# Altium schematic sheet LEDMATRIX.SchDoc
size D; SheetNumber: 1; SheetTotal: 1
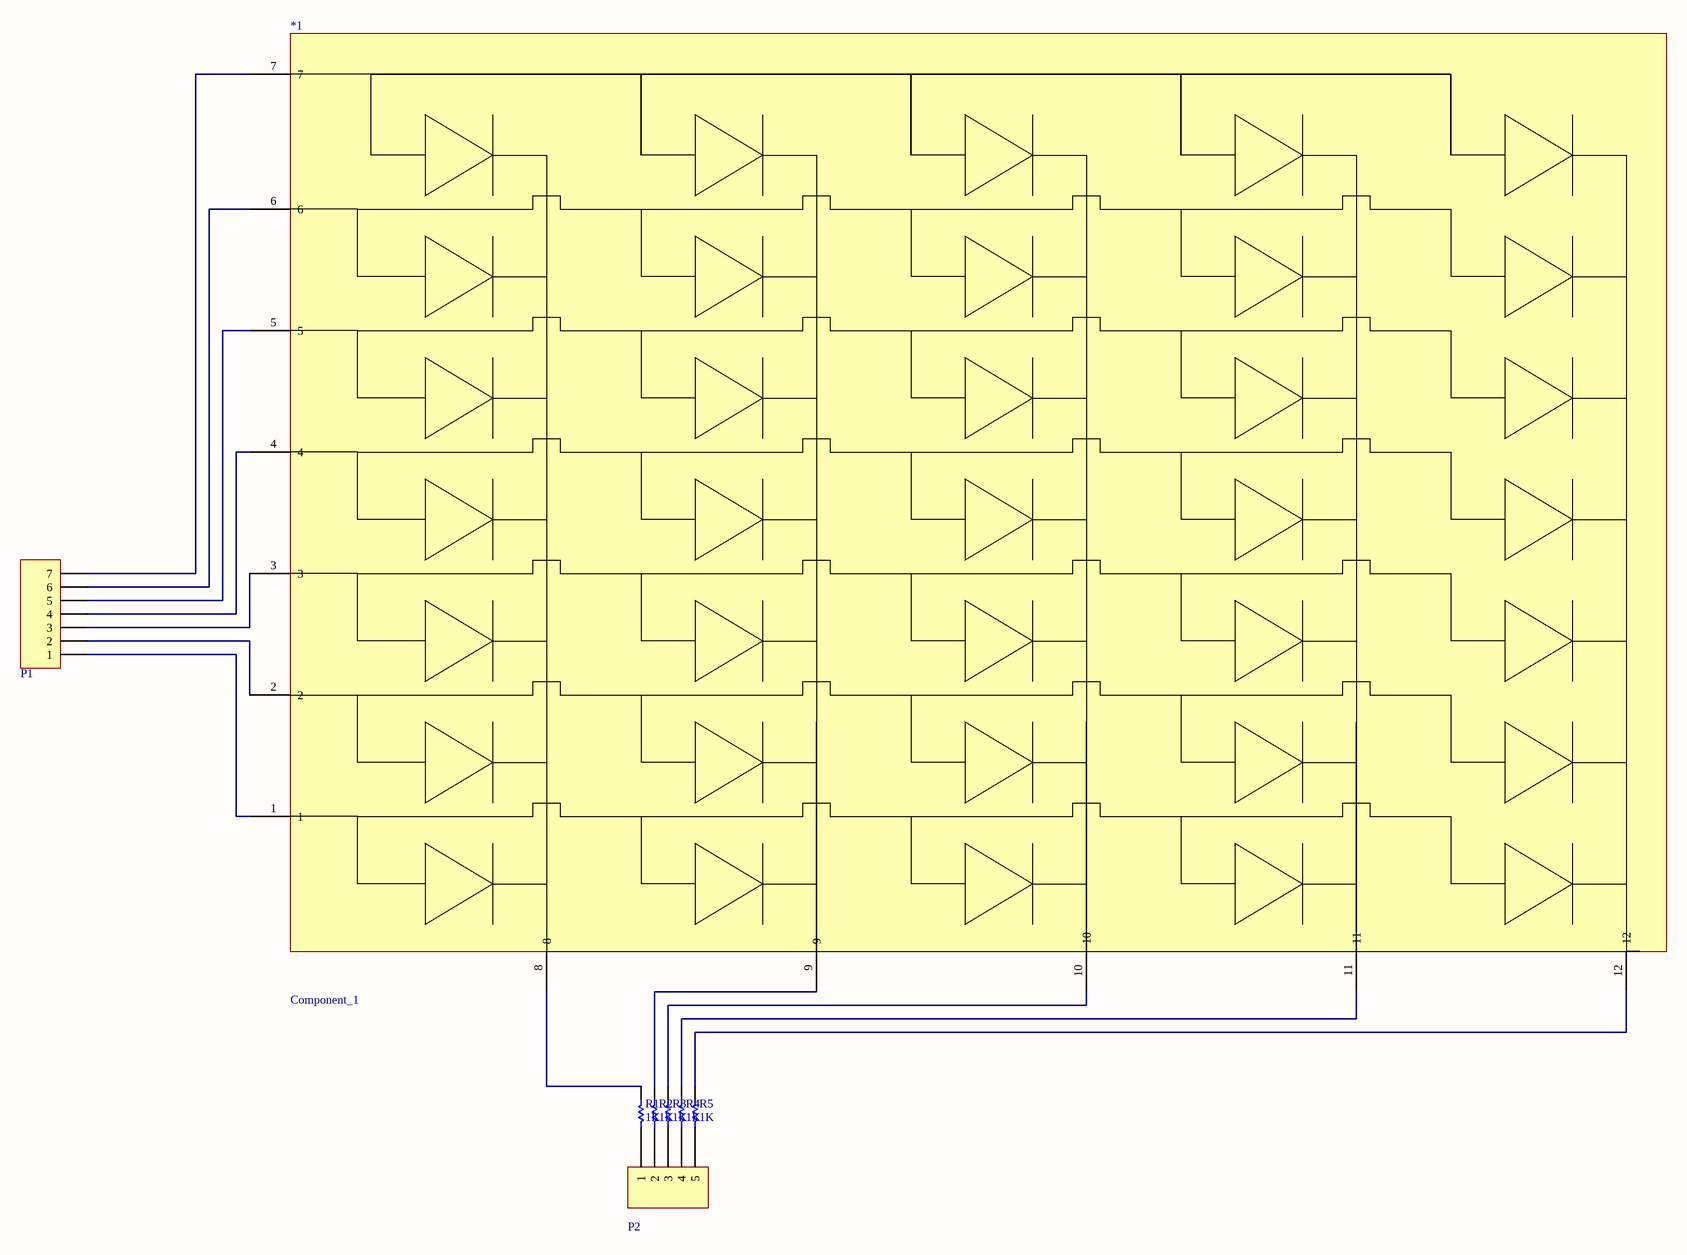
[diagram p0: LEDMATRIX.SchDoc]

## Parts
*1  Component_1  [PCBComponent_1]
P1  Header 7  [header 7]  (value not drawn)
P2  Header 5  [JP5]  (value not drawn)
R1  value 1K  [RES 1/2W]  (hidden comment: RESISTOR)
R2  value 1K  [RES 1/2W]  (hidden comment: RESISTOR)
R3  value 1K  [RES 1/2W]  (hidden comment: RESISTOR)
R4  value 1K  [RES 1/2W]  (hidden comment: RESISTOR)
R5  value 1K  [RES 1/2W]  (hidden comment: RESISTOR)

## Nets
Net*1_1: *1.1 P1.1
Net*1_2: *1.2 P1.2
Net*1_3: *1.3 P1.3
Net*1_4: *1.4 P1.4
Net*1_5: *1.5 P1.5
Net*1_6: *1.6 P1.6
Net*1_7: *1.7 P1.7
Net*1_8: *1.8 R1.1
Net*1_9: *1.9 R2.1
Net*1_10: *1.10 R3.1
Net*1_11: *1.11 R4.1
Net*1_12: *1.12 R5.1
NetP2_1: P2.1 R1.2
NetP2_2: P2.2 R2.2
NetP2_3: P2.3 R3.2
NetP2_4: P2.4 R4.2
NetP2_5: P2.5 R5.2

## Library data of the parts
P1 = Header 7: Header, 7-Pin; LatestRevisionDate: 17-Jul-2002; LatestRevisionNote: Re-released for DXP Platform.; Publisher: Altium Limited
P2 = Header 5: Header, 5-Pin; LatestRevisionDate: 17-Jul-2002; LatestRevisionNote: Re-released for DXP Platform.; Publisher: Altium Limited